# EAGLE schematic Super_iO_board (EAGLE 7.7.0)
Assembly variants: Var.: 001-SMD, Var.: 001-PIN, 001, 42067.001_PIN_TOP, 002 - LTE, 42067.002_LTE_PIN_TOP, 42068.002_LTE_SMD_TOP, PIN_TOP_vse
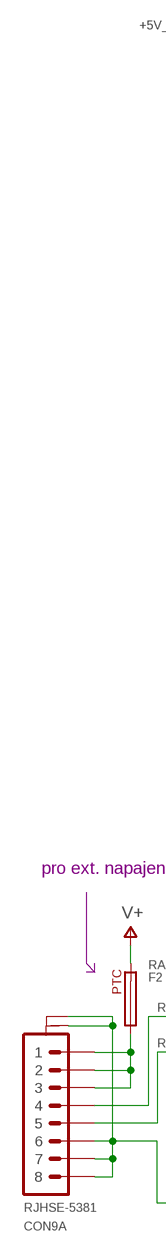
[diagram p0: schematic, sheet 1, part 1 of 2]
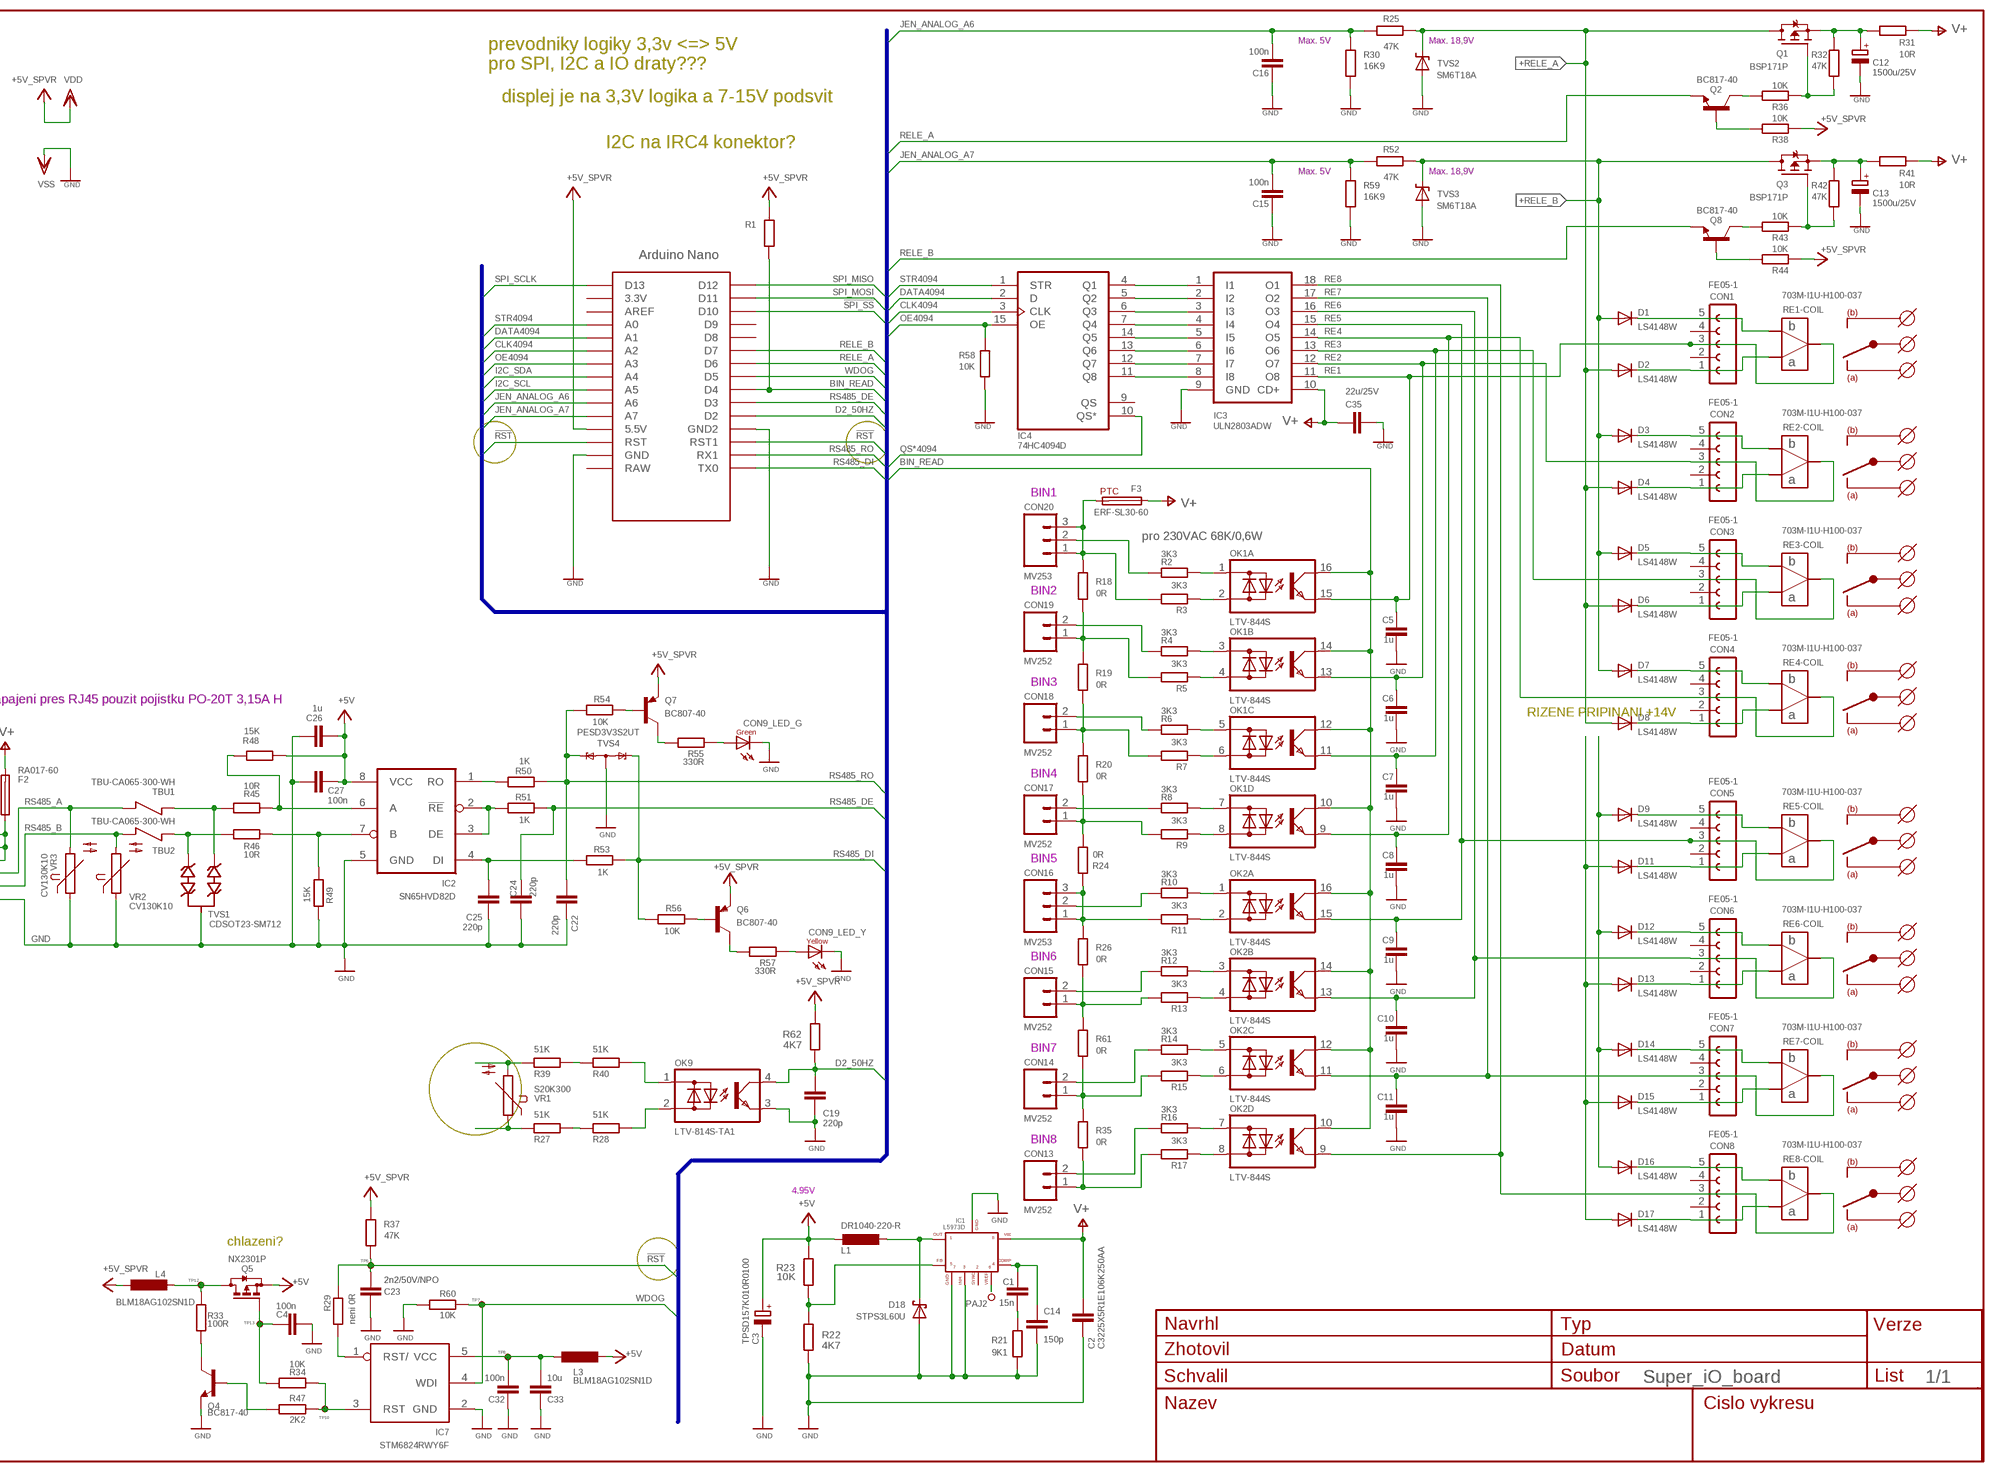
[diagram p1: schematic, sheet 1, part 2 of 2]

## Parts
C1  15n  C_EU_C0805C  [C0805C]
C2  C3225X5R1E106K250AA  C-EUC1210  [C1210]
C3  TPSD157K010R0100  CPOL-EUD/7343-31R  [D/7343-31R]
C4  100n  C_EU_C0805C-M  [C0805C-M]
C5  1u  C_EU_C0805C-M  [C0805C-M]
C6  1u  C_EU_C0805C-M  [C0805C-M]
C7  1u  C_EU_C0805C-M  [C0805C-M]
C8  1u  C_EU_C0805C-M  [C0805C-M]
C9  1u  C_EU_C0805C-M  [C0805C-M]
C10  1u  C_EU_C0805C-M  [C0805C-M]
C11  1u  C_EU_C0805C-M  [C0805C-M]
C12  1500u/25V  CPOL-EUE5-13  [E5-13]
C13  1500u/25V  CPOL-EUE5-13  [E5-13]
C14  150p  C_EU_C0805C  [C0805C]
C15  100n  C_EU_C0805C-M  [C0805C-M]
C16  100n  C_EU_C0805C-M  [C0805C-M]
C19  220p  C_EU_C0805C-M  [C0805C-M]
C22  220p  C_EU_C0805C-M  [C0805C-M]
C23  2n2/50V/NPO  C_EU_C0805C-M  [C0805C-M]
C24  220p  C_EU_C0805C-M  [C0805C-M]
C25  220p  C_EU_C0805C-M  [C0805C-M]
C26  1u  C_EU_C0805C-M  [C0805C-M]
C27  100n  C_EU_C0805C-M  [C0805C-M]
C32  100n  C_EU_C0805C-M  [C0805C-M]
C33  10u  C_EU_C0805C-M  [C0805C-M]
C35  22u/25V  C_EU_1206  [C1206]
CON1  FE05-1  [FE05-1]  (not fitted in variant Var.: 001-SMD)  (not fitted in variant Var.: 001-PIN)
CON2  FE05-1  [FE05-1]  (not fitted in variant Var.: 001-SMD)  (not fitted in variant Var.: 001-PIN)
CON3  FE05-1  [FE05-1]  (not fitted in variant Var.: 001-SMD)  (not fitted in variant Var.: 001-PIN)
CON4  FE05-1  [FE05-1]  (not fitted in variant Var.: 001-SMD)  (not fitted in variant Var.: 001-PIN)
CON5  FE05-1  [FE05-1]  (not fitted in variant Var.: 001-SMD)  (not fitted in variant Var.: 001-PIN)
CON6  FE05-1  [FE05-1]  (not fitted in variant Var.: 001-SMD)  (not fitted in variant Var.: 001-PIN)
CON7  FE05-1  [FE05-1]  (not fitted in variant Var.: 001-SMD)  (not fitted in variant Var.: 001-PIN)
CON8  FE05-1  [FE05-1]  (not fitted in variant Var.: 001-SMD)  (not fitted in variant Var.: 001-PIN)
CON9  RJHSE-5381  RJHSE5381_PROKOVY  [RJHSE538X_PROKOVY]
CON13  MV252  MRT5_2_61010-1_KULATE  [MRT5_2_61010-1_KULATE]
CON14  MV252  MRT5_2_61010-1_KULATE  [MRT5_2_61010-1_KULATE]
CON15  MV252  MRT5_2_61010-1_KULATE  [MRT5_2_61010-1_KULATE]
CON16  MV253  MRT5_3_61010-1_KULATE  [MRT5_3_61010-1_KULATE]
CON17  MV252  MRT5_2_61010-1_KULATE  [MRT5_2_61010-1_KULATE]
CON18  MV252  MRT5_2_61010-1_KULATE  [MRT5_2_61010-1_KULATE]
CON19  MV252  MRT5_2_61010-1_KULATE  [MRT5_2_61010-1_KULATE]
CON20  MV253  MRT5_3_61010-1_KULATE  [MRT5_3_61010-1_KULATE]
D1  LS4148W  1N41481206  [D1206]
D2  LS4148W  1N41481206  [D1206]
D3  LS4148W  1N41481206  [D1206]
D4  LS4148W  1N41481206  [D1206]
D5  LS4148W  1N41481206  [D1206]
D6  LS4148W  1N41481206  [D1206]
D7  LS4148W  1N41481206  [D1206]
D8  LS4148W  1N41481206  [D1206]
D9  LS4148W  1N41481206  [D1206]
D11  LS4148W  1N41481206  [D1206]
D12  LS4148W  1N41481206  [D1206]
D13  LS4148W  1N41481206  [D1206]
D14  LS4148W  1N41481206  [D1206]
D15  LS4148W  1N41481206  [D1206]
D16  LS4148W  1N41481206  [D1206]
D17  LS4148W  1N41481206  [D1206]
D18  STPS3L60U  SCHOTTKY-DIODESMD  [SMB]
F2  RA017-60  RA017-60017-60  [ERF-RA01760Z]
F3  ERF-SL30-60  ERF-SL030-60  [ERF-SL030]
IC1  L5973D  [HSOP8]
IC2  SN65HVD82D  ISL8487LEPIDLO  [SO8_IPC_LEPIDLO]  (not fitted in variant 42067.001_PIN_TOP)  (not fitted in variant 002 - LTE)  (not fitted in variant 42067.002_LTE_PIN_TOP)  (not fitted in variant 42068.002_LTE_SMD_TOP)  (not fitted in variant PIN_TOP_vse)
IC3  ULN2803ADW  ULN2803ASMD  [SO18W]
IC4  74HC4094D  4094D  [SO16]
IC7  STM6824RWY6F  STM6824SOT23-5L  [SOT23-5L]
L1  DR1040-220-R  L-EUDR1040_RUCNE  [DR1040_RUCNE]
L3  BLM18AG102SN1D  L-EUL0603  [L0603]
L4  BLM18AG102SN1D  L-EUL0603  [L0603]
OK1  LTV-844S  [SOIC254P1016X380-16N]
OK2  LTV-844S  [SOIC254P1016X380-16N]
OK9  LTV-814S-TA1  PC814SMD4-7_PLOSKY  [SMD4-7_PLOSKY]
PAJ2  PBM  MER_BOS11MM  [MER_BOD1MM]
Q1  BSP171P  BSP170P  [SOT223]
Q2  BC817-40  BC817VLNA  [SOT23_VLNA]
Q3  BSP171P  BSP170P  [SOT223]
Q4  BC817-40  BC817VLNA  [SOT23_VLNA]
Q5  NX2301P  BSS84VLNA  [SOT23_VLNA]
Q6  BC807-40  BC807VLNA  [SOT23BEC_VLNA]
Q7  BC807-40  BC807VLNA  [SOT23BEC_VLNA]
Q8  BC817-40  BC817VLNA  [SOT23_VLNA]
R1  R_EU_R1206-M  [RC1206N-M]
R2  3K3  R-EU_0207/8.5+1206  [0207/8.5+1206]
R3  3K3  R-EU_0207/8.5+1206  [0207/8.5+1206]
R4  3K3  R-EU_0207/8.5+1206  [0207/8.5+1206]
R5  3K3  R-EU_0207/8.5+1206  [0207/8.5+1206]
R6  3K3  R-EU_0207/8.5+1206  [0207/8.5+1206]
R7  3K3  R-EU_0207/8.5+1206  [0207/8.5+1206]
R8  3K3  R-EU_0207/8.5+1206  [0207/8.5+1206]
R9  3K3  R-EU_0207/8.5+1206  [0207/8.5+1206]
R10  3K3  R-EU_0207/8.5+1206  [0207/8.5+1206]
R11  3K3  R-EU_0207/8.5+1206  [0207/8.5+1206]
R12  3K3  R-EU_0207/8.5+1206  [0207/8.5+1206]
R13  3K3  R-EU_0207/8.5+1206  [0207/8.5+1206]
R14  3K3  R-EU_0207/8.5+1206  [0207/8.5+1206]
R15  3K3  R-EU_0207/8.5+1206  [0207/8.5+1206]
R16  3K3  R-EU_0207/8.5+1206  [0207/8.5+1206]
R17  3K3  R-EU_0207/8.5+1206  [0207/8.5+1206]
R18  0R  R-EU_R2512  [R2512]
R19  0R  R-EU_R2512  [R2512]
R20  0R  R-EU_R2512  [R2512]
R21  9K1  R_EU_R0805-M  [YAG_R0805-M]
R22  4K7  R_EU_R0805-M  [YAG_R0805-M]
R23  10K  R_EU_R0805-M  [YAG_R0805-M]
R24  0R  R-EU_0207/7  [0207/7]
R25  47K  R_EU_R0805-M  [YAG_R0805-M]
R26  0R  R-EU_R2512  [R2512]
R27  51K  R_EU_R1206-M  [RC1206N-M]
R28  51K  R_EU_R1206-M  [RC1206N-M]
R29  neni 0R  R_EU_R0805-M  [YAG_R0805-M]  (not fitted in variant 001)
R30  16K9  R_EU_R0805-M  [YAG_R0805-M]
R31  10R  R-EU_R2010  [R2010]
R32  47K  R_EU_R0805-M  [YAG_R0805-M]
R33  100R  R_EU_R1206-M  [RC1206N-M]
R34  10K  R_EU_R0805-M  [YAG_R0805-M]
R35  0R  R-EU_R2512  [R2512]
R36  10K  R_EU_R0805-M  [YAG_R0805-M]
R37  47K  R_EU_R0805-M  [YAG_R0805-M]
R38  10K  R_EU_R0805-M  [YAG_R0805-M]
R39  51K  R_EU_R1206-M  [RC1206N-M]
R40  51K  R_EU_R1206-M  [RC1206N-M]
R41  10R  R-EU_R2010  [R2010]
R42  47K  R_EU_R0805-M  [YAG_R0805-M]
R43  10K  R_EU_R0805-M  [YAG_R0805-M]
R44  10K  R_EU_R0805-M  [YAG_R0805-M]
R45  10R  R-EU_R2010  [R2010]
R46  10R  R-EU_R2010  [R2010]
R47  2K2  R_EU_R0805-M  [YAG_R0805-M]
R48  15K  R-EU_R1206  [R1206]
R49  15K  R-EU_R1206  [R1206]
R50  1K  R-EU_R0805  [R0805]
R51  1K  R-EU_R0805  [R0805]
R52  47K  R_EU_R0805-M  [YAG_R0805-M]
R53  1K  R-EU_R0805  [R0805]
R54  10K  R_EU_R0805-M  [YAG_R0805-M]
R55  330R  R-EU_R0805  [R0805]
R56  10K  R_EU_R0805-M  [YAG_R0805-M]
R57  330R  R-EU_R0805  [R0805]
R58  10K  R_EU_R0805-M  [YAG_R0805-M]
R59  16K9  R_EU_R0805-M  [YAG_R0805-M]
R60  10K  R_EU_R0805-M  [YAG_R0805-M]
R61  0R  R-EU_R2512  [R2512]
R62  4K7  R_EU_R0805-M  [YAG_R0805-M]
RE1  703M-I1U-H100-037  703M-NOPIN  [RELE_703_M-NOPIN]  (not fitted in variant Var.: 001-SMD)  (not fitted in variant Var.: 001-PIN)
RE2  703M-I1U-H100-037  703M-NOPIN  [RELE_703_M-NOPIN]  (not fitted in variant Var.: 001-SMD)  (not fitted in variant Var.: 001-PIN)
RE3  703M-I1U-H100-037  703M-NOPIN  [RELE_703_M-NOPIN]  (not fitted in variant Var.: 001-SMD)  (not fitted in variant Var.: 001-PIN)
RE4  703M-I1U-H100-037  703M-NOPIN  [RELE_703_M-NOPIN]  (not fitted in variant Var.: 001-SMD)  (not fitted in variant Var.: 001-PIN)
RE5  703M-I1U-H100-037  703M-NOPIN  [RELE_703_M-NOPIN]  (not fitted in variant Var.: 001-SMD)  (not fitted in variant Var.: 001-PIN)
RE6  703M-I1U-H100-037  703M-NOPIN  [RELE_703_M-NOPIN]  (not fitted in variant Var.: 001-SMD)  (not fitted in variant Var.: 001-PIN)
RE7  703M-I1U-H100-037  703M-NOPIN  [RELE_703_M-NOPIN]  (not fitted in variant Var.: 001-SMD)  (not fitted in variant Var.: 001-PIN)
RE8  703M-I1U-H100-037  703M-NOPIN  [RELE_703_M-NOPIN]  (not fitted in variant Var.: 001-SMD)  (not fitted in variant Var.: 001-PIN)
TBU1  TBU-CA065-300-WH  TBU-CA  [TBU-CA]
TBU2  TBU-CA065-300-WH  TBU-CA  [TBU-CA]
TP6  MER_BOD_1MM_PRUBEH  [MER_BOD_1MM]
TP7  MER_BOD_1MM_PRUBEH  [MER_BOD_1MM]
TP8  MER_BOD_1MM_PRUBEH  [MER_BOD_1MM]
TP10  MER_BOD_1MM_PRUBEH  [MER_BOD_1MM]
TP12  MER_BOD_1MM_PRUBEH  [MER_BOD_1MM]
TP13  MER_BOD_1MM_PRUBEH  [MER_BOD_1MM]
TVS1  CDSOT23-SM712  [SOT23_VLNA]
TVS2  SM6T18A  SUPPRESSOR-UNI  [SMBJ_POLARITA]
TVS3  SM6T18A  SUPPRESSOR-UNI  [SMBJ_POLARITA]
TVS4  PESD3V3S2UT  [SOT23_VLNA]
U$1  NANO  [NANO]
VR1  S20K300  [S20K300]
VR2  CV130K10  S10K175  [S10K175]
VR3  CV130K10  S10K175  [S10K175]

## Nets
!K4-A1: D11.A D13.A D15.A D17.A
!K4-B1: D9.A D12.A D14.A D16.A
!RST: C23.1 R29.2 R37.1 TP6.MB U$1.RST U$1.RST1
!SPI_SS: U$1.D10
+5V: C3.+ C26.1 C27.1 IC2.8(VCC) L1.2 L3.2 Q5.2(S) R23.2 R48.1
+5V_SPVR: L4.1 Q6.E Q7.E R1.2 R37.2 R38.1 R44.1 R62.2 U$1.5V(5.5V) ; supply symbol labelled VDD
+RELE_A: D2.A D4.A D6.A D8.A Q1.2(D) Q1.4(D) R25.2 TVS2.C
+RELE_B: D1.A D3.A D5.A D7.A Q3.2(D) Q3.4(D) R52.2 TVS3.C
BIN_READ: OK1.10(D:C) OK1.12(C:C) OK1.14(B:C) OK1.16(A:C) OK2.10(D:C) OK2.12(C:C) OK2.14(B:C) OK2.16(A:C) R1.1 U$1.D4
BJT: Q4.1(B) R47.2
CLK4094: IC4.3(CLK) U$1.A2
COMP: C1.2 C14.2 IC1.4(COMP)
D2_50HZ: C19.1 OK9.4(C) R62.1 U$1.D2
DATA4094: IC4.2(D) U$1.A1
FB: IC1.5(FB) R22.2 R23.1
FET: C4.2 Q5.1(G) R34.2 TP13.MB
GND: C2.2 C3.- C4.1 C5.2 C6.2 C7.2 C8.2 C9.2 C10.2 C11.2 C12.- C13.- C14.1 C15.1 C16.1 C19.2 C22.2 C23.2 C24.2 C25.2 C26.2 C27.2 C32.1 C33.1 C35.2 CON9.1_6 CON9.1_7 CON9.1_8 CON9.K1(_LED_G:K) CON9.K2(_LED_Y:K) CON9.S1(A:S1) CON9.S(A:S) D18.A IC1.3(INH) IC1.7(GND) IC1.GND(GND1) IC2.5(GND) IC3.9(GND) IC7.2(GND) OK9.3(E) Q4.2(E) R21.1 R22.1 R30.1 R49.2 R58.2 R59.1 R60.2 TVS1.3 TVS2.A TVS3.A TVS4.3(AA) U$1.GND U$1.GND1(GND2) VR2.1 VR3.1 ; supply symbol labelled VSS
I2C_SCL: U$1.A5
I2C_SDA: U$1.A4
JEN_ANALOG_A6: C16.2 R25.1 R30.2 U$1.A6
JEN_ANALOG_A7: C15.2 R52.1 R59.2 U$1.A7
N$1: CON1.5 D1.K(C)
N$2: CON1.1 D2.K(C)
N$3: CON2.5 D3.K(C)
N$4: CON2.1 D4.K(C)
N$5: CON3.5 D5.K(C)
N$6: CON3.1 D6.K(C)
N$7: CON4.5 D7.K(C)
N$8: CON8.1 D17.K(C)
N$9: Q4.3(C) R33.1
N$10: IC7.1(RST/) R29.1
N$11: CON4.1 D8.K(C)
N$12: IC2.1(RO) R50.1
N$13: CON5.5 D9.K(C)
N$14: L4.2 Q5.3(D) R33.2 TP12.MB
N$15: CON5.1 D11.K(C)
N$16: CON6.5 D12.K(C)
N$17: CON6.1 D13.K(C)
N$18: CON7.5 D14.K(C)
N$19: CON7.1 D15.K(C)
N$20: CON8.5 D16.K(C)
N$21: IC2.2(!RE) IC2.3(DE) R51.1
N$22: C25.1 IC2.4(DI) R53.1
N$23: R46.2 TBU2.1 TVS1.2
N$24: R45.2 TBU1.1 TVS1.1
N$25: IC2.7(B) R46.1 R49.1
N$26: R39.1 VR1.2
N$27: D18.C IC1.1(OUT) L1.1
N$28: R27.1 VR1.1
N$29: OK9.1(AC1) R40.2
N$30: IC2.6(A) R45.1 R48.2
N$31: OK9.2(AC2) R28.2
N$32: CON9.1_1 CON9.1_2 CON9.1_3 F2.P$1
N$33: Q7.C R55.1
N$34: Q7.B R54.2
N$35: Q6.C R57.1
N$36: Q6.B R56.2
N$37: CON9.A1(_LED_G:A) R55.2
N$38: CON9.A2(_LED_Y:A) R57.2
N$39: OK1.1(A:AC1) R2.2 R2.22
N$40: C1.1 R21.2
N$41: OK1.2(A:AC2) R3.1 R3.11
N$42: OK1.3(B:AC1) R4.2 R4.22
N$43: OK1.4(B:AC2) R5.1 R5.11
N$44: OK1.5(C:AC1) R6.2 R6.22
N$45: OK1.6(C:AC2) R7.1 R7.11
N$46: OK1.7(D:AC1) R8.2 R8.22
N$47: OK1.8(D:AC2) R9.1 R9.11
N$48: OK2.1(A:AC1) R10.2 R10.22
N$49: OK2.2(A:AC2) R11.1 R11.11
N$50: OK2.3(B:AC1) R12.2 R12.22
N$51: IC1.6(VREF) PAJ2.MB
N$52: OK2.4(B:AC2) R13.1 R13.11
N$53: OK2.5(C:AC1) R14.2 R14.22
N$54: OK2.6(C:AC2) R15.1 R15.11
N$55: OK2.7(D:AC1) R16.2 R16.22
N$56: OK2.8(D:AC2) R17.1 R17.11
N$57: CON13.1 R17.2 R17.22 R35.1
N$58: CON13.2 R16.1 R16.11
N$59: CON14.1 R15.2 R15.22 R35.2 R61.1
N$60: CON14.2 R14.1 R14.11
N$61: CON15.1 R13.2 R13.22 R26.1 R61.2
N$62: CON15.2 R12.1 R12.11
N$63: CON16.1 CON16.3 R11.2 R11.22 R24.1 R26.2
N$64: CON16.2 R10.1 R10.11
N$65: CON17.1 R9.2 R9.22 R20.1 R24.2
N$66: CON17.2 R8.1 R8.11
N$67: CON18.1 R7.2 R7.22 R19.1 R20.2
N$68: CON18.2 R6.1 R6.11
N$69: CON19.1 R5.2 R5.22 R18.1 R19.2
N$70: CON19.2 R4.1 R4.11
N$71: CON20.1 CON20.3 F3.P$2 R3.2 R3.22 R18.2
N$72: CON20.2 R2.1 R2.11
N$75: C12.+ Q1.3(S) R31.1 R32.2
N$76: Q1.1(G) R32.1 R36.1
N$77: Q2.3(C) R36.2
N$79: Q2.1(B) R38.2
N$80: C13.+ Q3.3(S) R41.1 R42.2
N$81: Q3.1(G) R42.1 R43.1
N$82: Q8.3(C) R43.2
N$83: Q8.1(B) R44.2
N$84: R39.2 R40.1
N$85: R27.2 R28.1
N$112: IC3.1(I1) IC4.4(Q1)
N$113: IC3.2(I2) IC4.5(Q2)
N$114: IC3.3(I3) IC4.6(Q3)
N$115: IC3.4(I4) IC4.7(Q4)
N$116: IC3.8(I8) IC4.11(Q8)
N$117: IC3.7(I7) IC4.12(Q7)
N$118: IC3.6(I6) IC4.13(Q6)
N$119: IC3.5(I5) IC4.14(Q5)
OE4094: IC4.15(OE) R58.1 U$1.A3
QS*4094: IC4.10(QS*)
RE1: C5.1 CON1.3 IC3.11(O8) OK1.15(A:E)
RE2: C6.1 CON2.3 IC3.12(O7) OK1.13(B:E)
RE3: C7.1 CON3.3 IC3.13(O6) OK1.11(C:E)
RE4: C8.1 CON4.3 IC3.14(O5) OK1.9(D:E)
RE5: C9.1 CON5.3 IC3.15(O4) OK2.15(A:E)
RE6: C10.1 CON6.3 IC3.16(O3) OK2.13(B:E)
RE7: C11.1 CON7.3 IC3.17(O2) OK2.11(C:E)
RE8: CON8.3 IC3.18(O1) OK2.9(D:E)
RELE_A: Q2.2(E) U$1.D6
RELE_B: Q8.2(E) U$1.D7
RS485_A: CON9.1_4 TBU1.2 VR3.2
RS485_B: CON9.1_5 TBU2.2 VR2.2
RS485_DE: C24.1 R51.2 U$1.D3
RS485_DI: R53.2 R56.1 TVS4.2(K2) U$1.TX0
RS485_RO: C22.1 R50.2 R54.1 TVS4.1(K1) U$1.RX1
RSTOUT: IC7.3(RST) R34.1 R47.1 TP10.MB
SPI_MISO: U$1.D12
SPI_MOSI: U$1.D11
SPI_SCLK: U$1.D13
STR4094: IC4.1(STR) U$1.A0
V+: C2.1 C35.1 F2.P$2 F3.P$1 IC1.8(VCC) IC3.10(CD+) R31.2 R41.2
VCC_STM: C32.2 C33.2 IC7.5(VCC) L3.1 TP8.MB
WDOG: IC7.4(WDI) R60.1 TP7.MB U$1.D5
Unconnected: CON1.2 CON1.4 CON2.2 CON2.4 CON3.2 CON3.4 CON4.2 CON4.4 CON5.2 CON5.4 CON6.2 CON6.4 CON7.2 CON7.4 CON8.2 CON8.4 IC1.2(SYNC) IC4.9(QS) U$1.3.3V U$1.AREF U$1.D8 U$1.D9 U$1.ICSP1 U$1.ICSP2 U$1.ICSP3 U$1.ICSP4 U$1.ICSP5 U$1.ICSP6 U$1.RAW

## Buses
B$1

## Notes on the sheet
- Max. 5V | Max. 18,9V
- prevodniky logiky 3,3v <=> 5V
  pro SPI, I2C a IO draty???
- displej je na 3,3V logika a 7-15V podsvit
- I2C na IRC4 konektor?
- Max. 5V | Max. 18,9V
- BIN1
- pro 230VAC 68K/0,6W
- BIN2
- BIN3
- pro ext. napajeni pres RJ45 pouzit pojistku PO-20T 3,15A H
- RIZENE PRIPINANI +14V
- BIN4
- BIN5
- BIN6
- BIN7
- BIN8
- 4.95V
- chlazeni?

## Power pins joined to a net without a drawn wire
VDD: IC4.16(VDD)
VSS: IC4.8(VSS)

## Library data of the parts
C1 C4-C11 C14-C16 C19 C22-C27 C32 C33 C35 = smd-ipc:C_EU
C2 = rcl:C-EU: CAPACITOR, European symbol
C3 C12 C13 = rcl:CPOL-EU: POLARIZED CAPACITOR, European symbol
CON1-CON8 = con-lsta:FE05-1: FEMALE HEADER
CON9 = Konektory:RJHSE5381
CON13-CON15 CON17-CON19 = Konektory:MRT5_2
CON16 CON20 = Konektory:MRT5_3
D1-D9 D11-D17 = diode:1N4148: DIODE high speed (Philips)
D18 = diode:SCHOTTKY-DIODE: Schottky Diode
F2 = fuse:RA017-60
F3 = fuse:ERF-SL030-60
IC1 = IC@3:L5973D
IC2 = IC:ISL8487
IC3 = uln-udn:ULN2803A: DRIVER ARRAY
IC4 = 40xx:4094: 8-stage SHIFT/STORE REGISTER, tri-state
IC7 = st-microelectronics_1:STM6824
L1 L3 L4 = rcl:L-EU: INDUCTOR, European symbol
OK1 OK2 = optocoupler:LTV-844S
OK9 = optocoupler:PC814: SHARP OPTO COUPLER
PAJ2 = ##KONSTR:MER_BOS1
Q1 Q3 = transistor-fet:BSP170P: SIPMOS(R) Small-Signal-Transistor P-Channel, Enhancement mode Source: http://www.infineon.com/upload/Document/BSP170P_Rev2.4.pdf
Q2 Q4 Q8 = transistor-npn:BC817*: NPN Transistor
Q5 = transistor-small-signal:BSS84: P-CHANNEL MOS FET
Q6 Q7 = transistor-pnp:BC807*: PNP Transistror
R1 R21-R23 R25 R27-R30 R32-R34 R36-R40 R42-R44 R47 R52 R54 R56 R58-R60 R62 = smd-ipc:R_EU
R2-R20 R24 R26 R31 R35 R41 R45 R46 R48-R51 R53 R55 R57 R61 = rcl:R-EU_: RESISTOR, European symbol
RE1-RE8 = Gruner Relay:703M-NOPIN
TBU1 TBU2 = transil:TBU-CA
TP6-TP8 TP10 TP12 TP13 = ##KONSTR:MER_BOD_1MM_PRUBEH
TVS1 = transil:CDSOT23-SM712
TVS2 TVS3 = diode:SUPPRESSOR-: Suppressor diode
TVS4 = diode:PESD3V3S2UT
U$1 = Arduino-clone:NANO: Arduino Nano
VR1 = varistor:S20K300: VARISTOR
VR2 VR3 = varistor:S10K175: VARISTOR